# Altium project LOGI-BONE.PrjPcb (part 1 of 2)
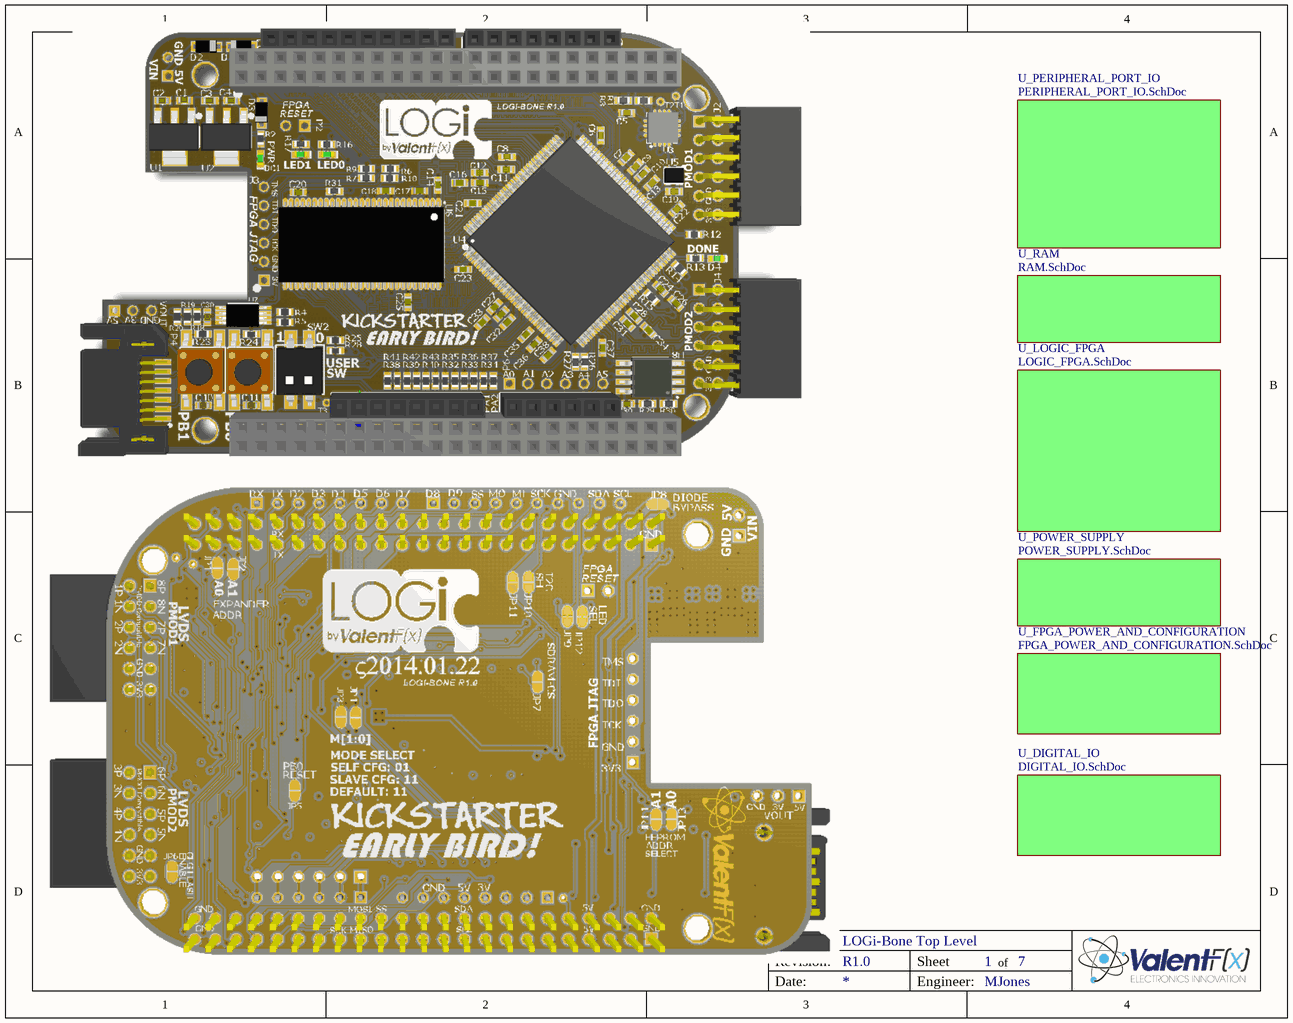
[diagram p0: LOGi_Bone_Top.SchDoc]
Engineer: MJ/EH; PCB_TITLE: FPGA Mark 1; PCB_VERSION: a; PrjEngineer: MJones; PrjRevision: R1.0; Revision: R1.0
7 sheets, 132 parts. Net scope: flat (ports and power ports of the same name join across sheets).
Board file: LOGI-BONE.PcbDoc
Sheets:
  LOGi_Bone_Top.SchDoc
    U_DIGITAL_IO = DIGITAL_IO.SchDoc
    U_FPGA_POWER_AND_CONFIGURATION = FPGA_POWER_AND_CONFIGURATION.SchDoc
    U_LOGIC_FPGA = LOGIC_FPGA.SchDoc
    U_PERIPHERAL_PORT_IO = PERIPHERAL_PORT_IO.SchDoc
    U_POWER_SUPPLY = POWER_SUPPLY.SchDoc
    U_RAM = RAM.SchDoc

## Sheet LOGi_Bone_Top.SchDoc: LOGi-Bone Top Level
size A; Organization: Michael Jones; DocumentNumber: 1; SheetNumber: 1; SheetTotal: 7; PageSetup: Record=PageOptions|CenterHorizontal=True|CenterVertical=True|PrintScale=1.12|XCorrection=1.00|YCorrection=1.00|PrintKind=0|BorderSize=5000000|LeftOffset=0|BottomOffset=0|Orientation=2|PaperLength=1000|PaperWidth=1000|Scale=100|PaperSource=7|PrintQuality=-4|MediaType=1|DitherType=10|PaperKind=Letter|PrintScaleMode=1

### Sub-sheets
U_DIGITAL_IO = DIGITAL_IO.SchDoc: no entries
U_FPGA_POWER_AND_CONFIGURATION = FPGA_POWER_AND_CONFIGURATION.SchDoc: no entries
U_LOGIC_FPGA = LOGIC_FPGA.SchDoc: no entries
U_PERIPHERAL_PORT_IO = PERIPHERAL_PORT_IO.SchDoc: no entries
U_POWER_SUPPLY = POWER_SUPPLY.SchDoc: no entries
U_RAM = RAM.SchDoc: no entries

### Notes on the sheet
- Title
- Revision:
- Sheet
- of
- Date:
- Engineer:

## Sheet DIGITAL_IO.SchDoc: Digital IO
size B; Engineer: M. Jones; Organization: Michael Jones; DocumentNumber: 6; Revision: RA.1; SheetNumber: 6; SheetTotal: 7
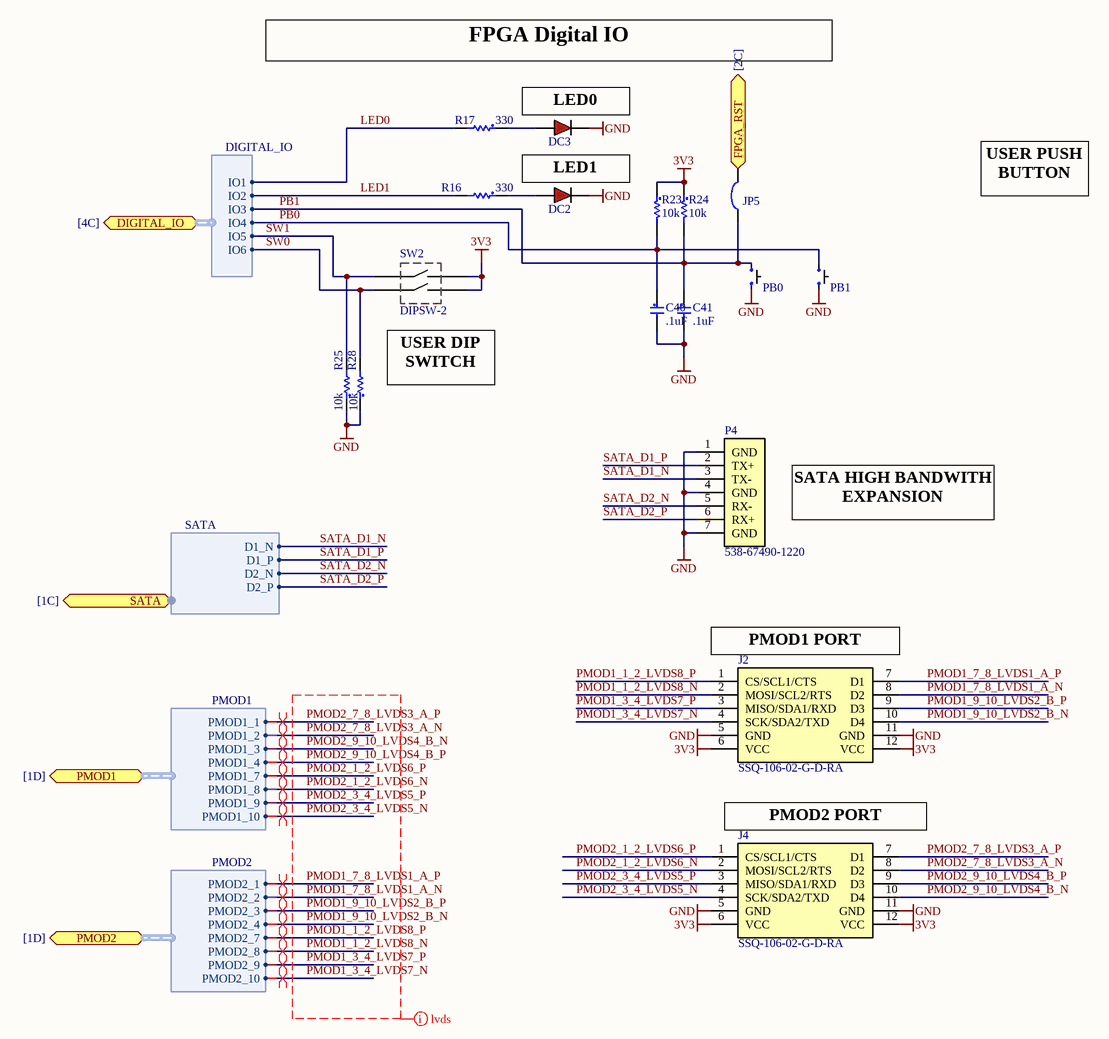
[diagram p1: DIGITAL_IO.SchDoc]

### Parts
C40  .1uF  [c0603]
C41  .1uF  [c0603]
DC2  598-8010-107F  [LED_0603 - RED]  (value not drawn)
DC3  598-8010-107F  [LED_0603 - RED]  (value not drawn)
J2  SSQ-106-02-G-D-RA  [PMOD HEADER - SSQ-106-02-G-D-RA]
J4  SSQ-106-02-G-D-RA  [PMOD HEADER - SSQ-106-02-G-D-RA]
JP5  Solder Jumper  [SOLDER_JUMPER]  (value not drawn)  (no BOM)
P4  Supplier Part Number 1: 538-67490-1220  [SATA - 67490-3220]  (hidden comment: SATA - 67490-1220)
PB0  (no value)  [FSM4JSMA]
PB1  (no value)  [FSM4JSMA]
R16  330  [R0603]
R17  330  [R0603]
R23  10k  [R0603]
R24  10k  [R0603]
R25  10k  [R0603]
R28  10k  [R0603]
SW2  DIPSW-2  [DIPSW - 219-2MST]

### Ports
DIGITAL_IO (harness DIGITAL_IO, see [4C]), FPGA_RST (see [2C]), PMOD1 (harness PMOD1, see [1D]), PMOD2 (harness PMOD2, see [1D]), SATA (harness SATA, see [1C])

### Harnesses
DIGITAL_IO: IO1, IO2, IO3, IO4, IO5, IO6
SATA: D1_P, D1_N, D2_N, D2_P
PMOD1: PMOD1_1, PMOD1_2, PMOD1_3, PMOD1_4, PMOD1_7, PMOD1_8, PMOD1_9, PMOD1_10
PMOD2: PMOD2_1, PMOD2_2, PMOD2_3, PMOD2_4, PMOD2_7, PMOD2_8, PMOD2_9, PMOD2_10

### Nets
3V3: J2.6(VCC) J2.12(VCC) J4.6(VCC) J4.12(VCC) R23.1 R24.1 SW2.B1 SW2.B2
GND: C40.2 C41.2 DC2.C DC3.C J2.5(GND) J2.11(GND) J4.5(GND) J4.11(GND) P4.1(GND) P4.4(GND) P4.7(GND) PB0.A PB1.A R25.1 R28.1
FPGA_RST/CFG_PROGB: JP5.2 ; port FPGA_RST
LED0: R17.2 ; port DIGITAL_IO.IO1
LED1: R16.2 ; port DIGITAL_IO.IO2
PB0: C40.1 PB1.B R23.2 ; port DIGITAL_IO.IO4
PB1: C41.1 JP5.1 PB0.B R24.2 ; port DIGITAL_IO.IO3
PMOD1_1_2_LVDS8_N: J2.2(MOSI/SCL2/RTS) ; port PMOD2.PMOD2_8
PMOD1_1_2_LVDS8_P: J2.1(CS/SCL1/CTS) ; port PMOD2.PMOD2_7
PMOD1_3_4_LVDS7_N: J2.4(SCK/SDA2/TXD) ; port PMOD2.PMOD2_10
PMOD1_3_4_LVDS7_P: J2.3(MISO/SDA1/RXD) ; port PMOD2.PMOD2_9
PMOD1_7_8_LVDS1_A_N: J2.8(D2) ; port PMOD2.PMOD2_2
PMOD1_7_8_LVDS1_A_P: J2.7(D1) ; port PMOD2.PMOD2_1
PMOD1_9_10_LVDS2_B_N: J2.10(D4) ; port PMOD2.PMOD2_4
PMOD1_9_10_LVDS2_B_P: J2.9(D3) ; port PMOD2.PMOD2_3
PMOD2_1_2_LVDS6_N: J4.2(MOSI/SCL2/RTS) ; port PMOD1.PMOD1_8
PMOD2_1_2_LVDS6_P: J4.1(CS/SCL1/CTS) ; port PMOD1.PMOD1_7
PMOD2_3_4_LVDS5_N: J4.4(SCK/SDA2/TXD) ; port PMOD1.PMOD1_10
PMOD2_3_4_LVDS5_P: J4.3(MISO/SDA1/RXD) ; port PMOD1.PMOD1_9
PMOD2_7_8_LVDS3_A_N: J4.8(D2) ; port PMOD1.PMOD1_2
PMOD2_7_8_LVDS3_A_P: J4.7(D1) ; port PMOD1.PMOD1_1
PMOD2_9_10_LVDS4_B_N: J4.10(D4) ; port PMOD1.PMOD1_3
PMOD2_9_10_LVDS4_B_P: J4.9(D3) ; port PMOD1.PMOD1_4
SATA_D1_N: P4.3(TX-) ; port SATA.D1_N
SATA_D1_P: P4.2(TX+) ; port SATA.D1_P
SATA_D2_N: P4.5(RX-) ; port SATA.D2_N
SATA_D2_P: P4.6(RX+) ; port SATA.D2_P
SW0: R28.2 SW2.A2 ; port DIGITAL_IO.IO6
SW1: R25.2 SW2.A1 ; port DIGITAL_IO.IO5
NetDC2_A: DC2.A R16.1
NetDC3_A: DC3.A R17.1

### Layout directives
differential pair: PMOD1_1_2_LVDS8_N, PMOD1_1_2_LVDS8_P, PMOD1_3_4_LVDS7_N, PMOD1_3_4_LVDS7_P, PMOD1_7_8_LVDS1_A_N, PMOD1_7_8_LVDS1_A_P, PMOD1_9_10_LVDS2_B_N, PMOD1_9_10_LVDS2_B_P, PMOD2_1_2_LVDS6_N, PMOD2_1_2_LVDS6_P, PMOD2_3_4_LVDS5_N, PMOD2_3_4_LVDS5_P, PMOD2_7_8_LVDS3_A_N, PMOD2_7_8_LVDS3_A_P, PMOD2_9_10_LVDS4_B_N, PMOD2_9_10_LVDS4_B_P
net class lvds: PMOD1_1_2_LVDS8_N, PMOD1_1_2_LVDS8_P, PMOD1_3_4_LVDS7_N, PMOD1_3_4_LVDS7_P, PMOD1_7_8_LVDS1_A_N, PMOD1_7_8_LVDS1_A_P, PMOD1_9_10_LVDS2_B_N, PMOD1_9_10_LVDS2_B_P, PMOD2_1_2_LVDS6_N, PMOD2_1_2_LVDS6_P, PMOD2_3_4_LVDS5_N, PMOD2_3_4_LVDS5_P, PMOD2_7_8_LVDS3_A_N, PMOD2_7_8_LVDS3_A_P, PMOD2_9_10_LVDS4_B_N, PMOD2_9_10_LVDS4_B_P

### Notes on the sheet
- FPGA Digital IO
- (near DC3) LED0
- (near DC2) LED1
- USER PUSH BUTTON
- USER DIP SWITCH
- SATA HIGH BANDWITH EXPANSION
- (near J2) PMOD1 PORT
- (near J4) PMOD2 PORT
- Title
- Revision:
- Sheet
- of
- Date:
- Engineer:

### Library data of the parts
C40 C41 = C0603 - CL10F104ZA8NNNC: CAP CER 0.1UF 25V Y5V 0603; Manufacturer: Samsung Electro-Mechanics America, Inc; Capacitance: 0.1µF; Tolerance: -20%, +80%; Temperature Coefficient: Y5V (F); Accept Alternative: Yes; Value: .1uF; Supplier 1: Digi-Key; Supplier Part Number 1: 1276-1011-1-ND; Manufacturer Part Number: CL10F104ZA8NNNC; RoHS: RoHS Compliant; Category: Capacitors; Stock 1: 400907; Pricing 1: 1=0.1, 10=0.017, 25=0.012, 50=0.009, 100=0.0076, 250=0.00624, 500=0.00536, 1000=0.00417 (USD); Package / Case: 0603 (1608 Metric); Packaging: Cut Tape (CT); ComponentLink1URL: http://www.samsungsem.com/servlet/FileDownload?type=spec&file=CL10F104ZA8NNNC.pdf; ComponentLink1Description: http://www.samsungsem.com/servlet/FileDownload?type=spec&file=CL10F104ZA8NNNC.pdf; Voltage - Rated: 25V; Mounting Type: Surface Mount, MLCC; Operating Temperature: -30°C ~ 85°C; Applications: General Purpose; Ratings: -; Size / Dimension: 0.063" L x 0.031" W (1.60mm x 0.80mm); Height - Seated (Max): -; Thickness (Max): 0.035" (0.90mm); Lead Spacing: -; Features: -; Lead Style: -; Accept Compatible Replacement Part: Yes
DC2 DC3 = LED0603 - 598-8010-107F: LED ALINGAP RED CLEAR 0603 SMD; Manufacturer: Dialight; Current - Test: 20mA; Wavelength - Dominant: 635nm; Millicandela Rating: 40mcd; Voltage - Forward (Vf) Typ: 2.2V; Lens Style/Size: Rectangle with Flat Top, 1.1mm x 0.8mm; Viewing Angle: 140°; Accept Replacement: YES - Water Clear; Supplier 1: Digi-Key; Manufacturer Part Number: 598-8010-107F; RoHS: RoHS Compliant; Category: Optoelectronics; Stock 1: 37578; Pricing 1: 1=0.45, 10=0.33, 25=0.264, 100=0.1749, 250=0.1452, 500=0.1056, 1000=0.0825 (USD); Color: Red; Luminous Flux @ Current - Test: -; Wavelength - Peak: -; Lens Type: Clear; Size / Dimension: 1.60mm L x 0.80mm W; Height: 0.70mm; Package / Case: 0603 (1608 Metric); Mounting Type: Surface Mount; Packaging: Digi-Reel®; ComponentLink1URL: http://media.digikey.com/pdf/Data%20Sheets/Dialight%20PDFs/598_Series_0603_Pkg.pdf; ComponentLink1Description: http://media.digikey.com/pdf/Data%20Sheets/Dialight%20PDFs/598_Series_0603_Pkg.pdf; Supplier Part Number 1: 350-2029-6-ND
J2 J4 = P-MOD - SSQ-106-02-G-D-RA: SAMTEC - SSQ-106-02-G-D-RA-005 - 2MM SOCKET STRIPS; Supplier 1: Samtec; Supplier Part Number 1: SSQ-106-02-G-D-RA; Manufacturer: SAMTEC; Manufacturer Part Number: SSQ-106-02-G-D-RA; Stock 1: 0; Pricing 1: 1=1.58, 100=1.58, 1000=1.58 (USD); Value: SSQ-106-02-G-D-RA
JP5 = Solder Jumper: Solder/Configuration Jumper; Manufacturer: n/a; Manufacturer Part Number: n/a; Source: n/a; Source Part Number: n/a; ROHS Certificate: n/a
P4 = SATA - 67490-1220: SATA Data - 67490-1220; Manufacturer: Molex; 1Notes: looks more standard need, different footprint; Gender: Male; Pitch: 1.27 mm; Number of Positions / Contacts: 7; Supplier 1: Mouser; Manufacturer Part Number: 67490-1220; RoHS: RoHS Compliant; Category: I/O Connectors; Stock 1: 475; Pricing 1: 1=1.28, 10=1.07, 100=0.792, 500=0.640, 1000=0.572, 2000=0.525 (AUD); Packaging: Tray; Product: SATA Connectors; Termination Style: Solder Terminal; Mounting Style: SMD/SMT; Product Category: 1.27mm Connectors; Standard Pack Qty: 2880; RoHS - Mouser: Y; Minimum Order Quantity: 1; Reeling: False; ComponentLink1URL: http://www.molex.com/webdocs/datasheets/pdf/en-us/0674901220_PCB_HEADERS.pdf; ComponentLink1Description: http://www.molex.com/webdocs/datasheets/pdf/en-us/0674901220_PCB_HEADERS.pdf
PB0 PB1 = FSM4JSMATR: SWITCH TACTILE SPST-NO 0.05A 12V; Manufacturer: TE Connectivity; Switch Function: Off-Mom; Contact Rating @ Voltage: 0.05A @ 12VDC; Actuator Type: Standard; Outline: 6.00mm x 6.00mm; Illumination: Non-Illuminated; Operating Force: 160gf; Actuator Height off PCB, from Pins: 5.00mm; Actuator Orientation: Top Actuated; Actuator Material: Polyphenylene Sulfide (PPS); Switch Travel: 0.25mm; Mechanical Life: 100,000 Cycles; Supplier 1: Digi-Key; Supplier Part Number 1: 450-1129-ND; Manufacturer Part Number: FSM4JSMA; RoHS: RoHS Compliant; Category: Switches; Stock 1: 13038; Pricing 1: 1=0.26, 10=0.246, 25=0.2096, 50=0.1834, 100=0.1703, 250=0.15064, 500=0.1441, 1000=0.1179, 5000=0.09825 (USD); Circuit: SPST-NO; Mounting Type: Surface Mount; Termination Style: Gull Wing; Packaging: Bulk; ComponentLink1URL: http://www.te.com/commerce/DocumentDelivery/DDEController?Action=srchrtrv&DocNm=2-1437565-7&DocType=Customer+Drawing&DocLang=English; ComponentLink1Description: http://www.te.com/commerce/DocumentDelivery/DDEController?Action=srchrtrv&DocNm=2-1437565-7&DocType=Customer+Drawing&DocLang=English; Illumination Voltage (Nominal): -; Illumination Type, Color: -; Ingress Protection: -; Features: -; Operating Temperature: -35°C ~ 85°C
R16 R17 = R0603 - ERJ-3GEYJ331V: Thick Film Resistors - SMD 0603 330ohms 5% Tol; Manufacturer: Panasonic; Temperature Coefficient: 200 PPM / C; Power Rating: 100 mW; Voltage Rating: 75 V; Manufacturer Part Number: ERJ-3GEYJ331V; Value: 330; Supplier 1: Mouser; Supplier Part Number 1: 667-ERJ-3GEYJ331V; RoHS: RoHS Compliant By Exemption; Category: Thick Film Resistors - SMD; Stock 1: 131470; Pricing 1: 1=0.108, 10=0.012, 100=0.005, 1000=0.004, 5000=0.003 (AUD); Tolerance: 5 %; Packaging: Reel; Package / Case: 0603 (1608 metric); ComponentLink1URL: http://www.mouser.com/ds/2/315/AOA0000CE1-37422.pdf; ComponentLink1Description: http://www.mouser.com/ds/2/315/AOA0000CE1-37422.pdf; Dimensions: 0.8 mm W x 1.6 mm L x 0.45 mm H; Operating Temperature Range: - 55 C to + 155 C; Product: Thick Film Resistors SMD; Resistance: 330 Ohms; Series: ERJ; Termination Style: SMD/SMT; Case Code - in: 0603; Case Code - mm: 1608; Standard Pack Qty: 5000; RoHS - Mouser: E; Minimum Order Quantity: 1; Reeling: True
R23-R25 R28 = R0603 - CRCW060310K0FKEA: 10k Thick Film Resistors - SMD 1/10watt 10Kohms 1%; Manufacturer: Vishay Dale; Power (Watts): 0.1W, 1/10W; Temperature Coefficient: ±100ppm/°C; Supplier 1: Digi-Key; Manufacturer Part Number: CRCW060310K0FKEA; RoHS: RoHS Compliant; Category: Resistors; Stock 1: 997856; Pricing 1: 10=0.081, 50=0.0436, 200=0.0251, 1000=0.01711 (USD); Resistance (Ohms): 10K; Composition: Thick Film; Features: -; Tolerance: ±1%; Package / Case: 0603 (1608 Metric); Size / Dimension: 0.061" L x 0.033" W (1.55mm x 0.85mm); Height: 0.020" (0.50mm); Number of Terminations: 2; Packaging: Cut Tape (CT); ComponentLink1URL: http://www.vishay.com/doc?20035; ComponentLink1Description: http://www.vishay.com/doc?20035; Supplier Part Number 1: 541-10.0KHCT-ND; Value: 10k
SW2 = DIPSW - 219-2MST: DIP Switches / SIP Switches SPST 2 switch sections; Manufacturer: CTS Electronic Components; Number of Positions: 2; Supplier 1: Mouser; Manufacturer Part Number: 219-2MST; RoHS: RoHS Compliant; Category: DIP Switches / SIP Switches; Stock 1: 3237; Pricing 1: 1=0.580, 10=0.530, 100=0.480, 500=0.350, 1000=0.300, 5000=0.270 (USD); Operating Temperature Range: - 55 C to + 85 C; Packaging: Tube; Terminal Pitch: 2.54 mm; Termination Style: SMD/SMT; Switch Type: DIP; Product Category: DIP Switches; RoHS - Mouser: Y; Minimum Order Quantity: 1; Reeling: False; ComponentLink1URL: http://www.ctscorp.com/components/Datasheets/219.pdf; ComponentLink1Description: http://www.ctscorp.com/components/Datasheets/219.pdf; Supplier Part Number 1: 774-2192MST

## Sheet FPGA_POWER_AND_CONFIGURATION.SchDoc: FPGA Configuration
size B; Engineer: M. Jones; Organization: Michael Jones; DocumentNumber: 3; Revision: R1.0; SheetNumber: 3; SheetTotal: 7
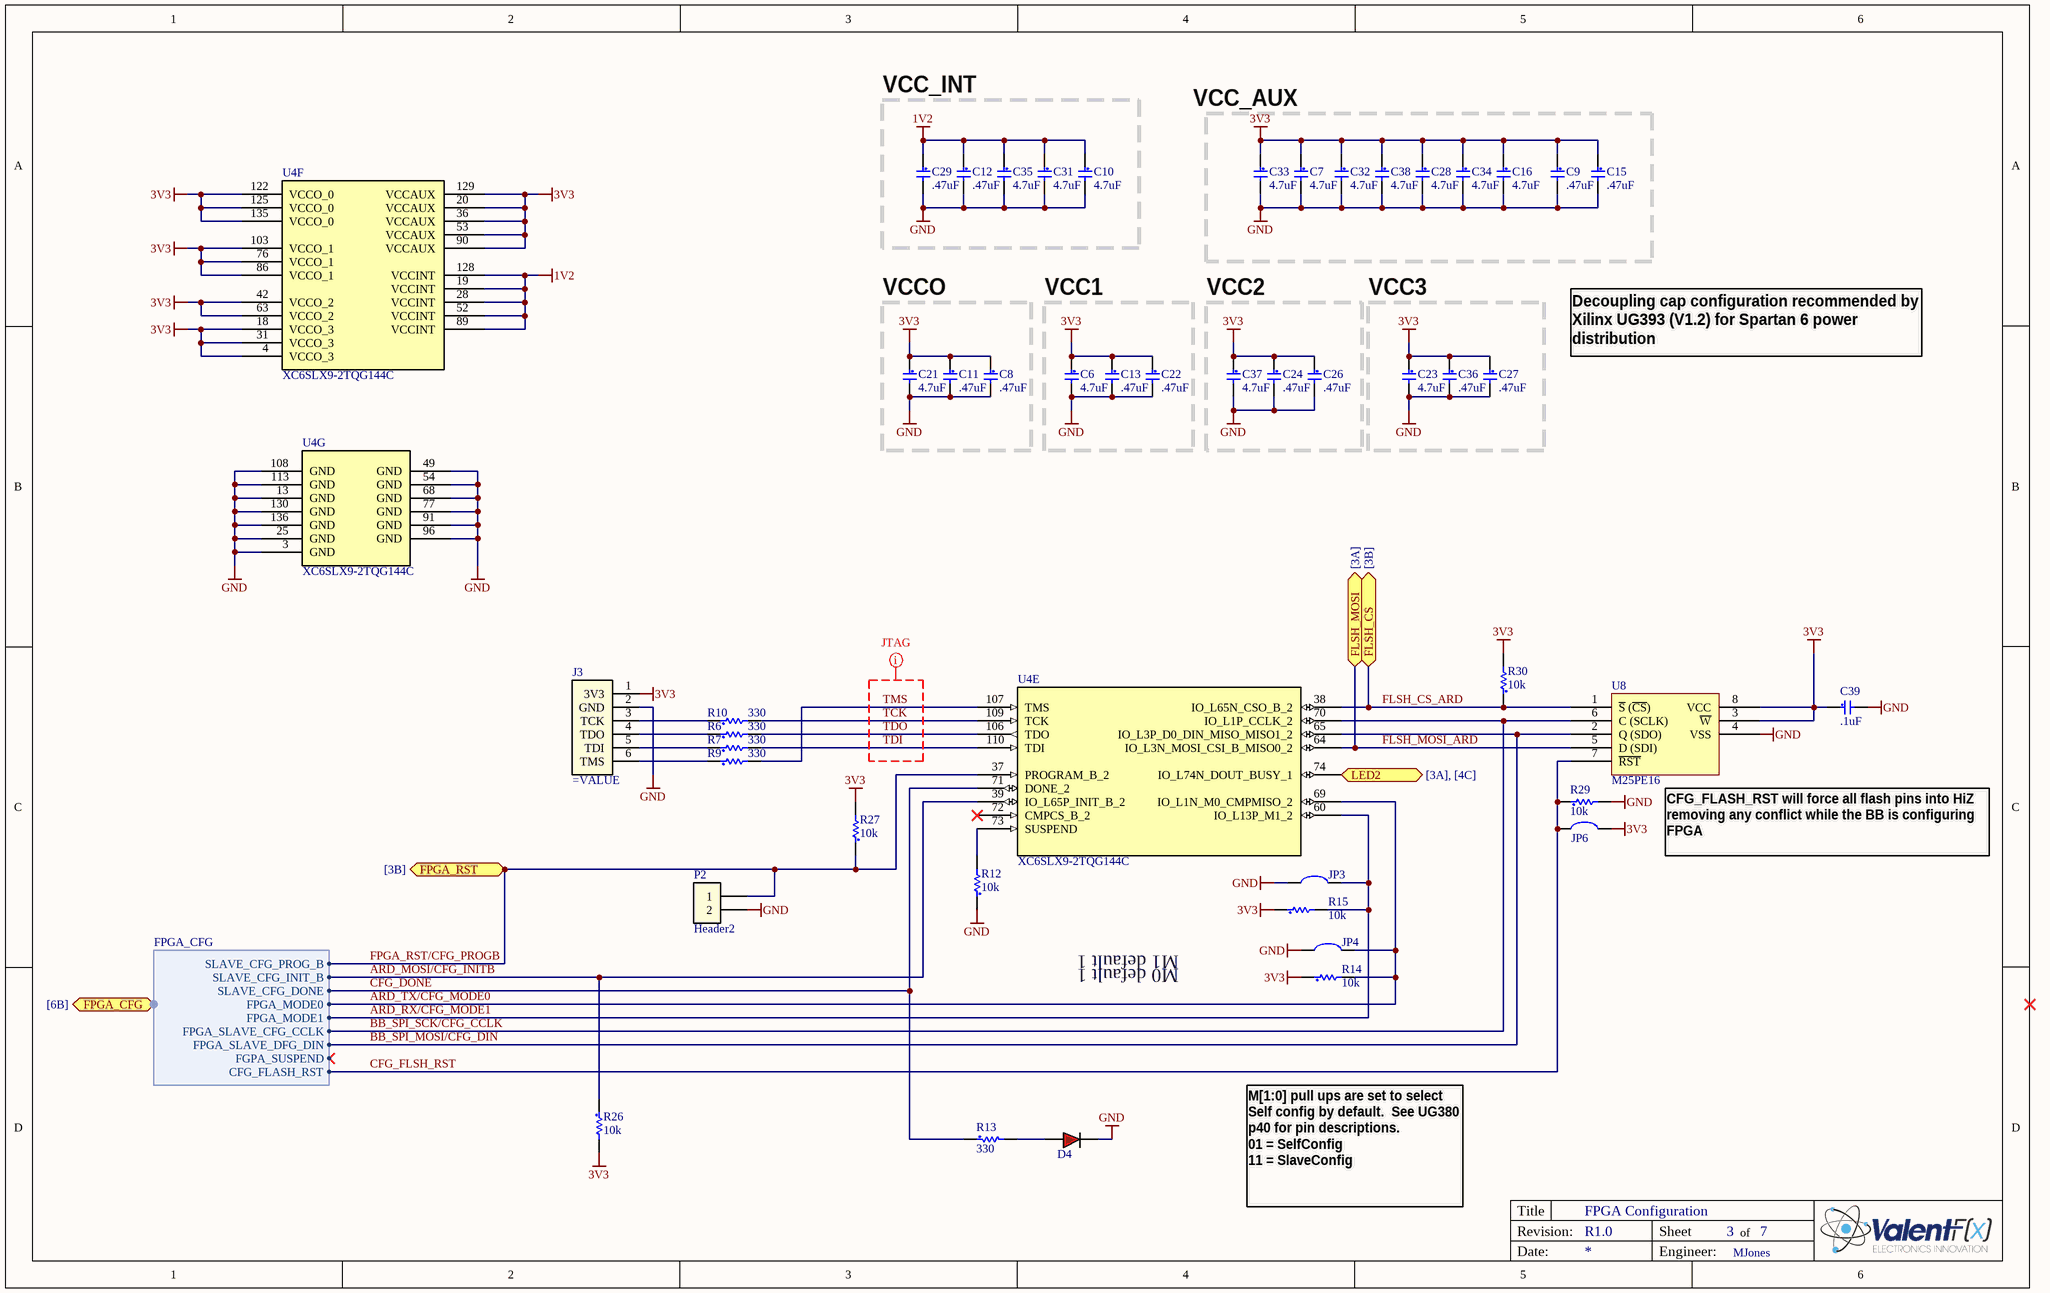
[diagram p2: FPGA_POWER_AND_CONFIGURATION.SchDoc]

### Parts
C6  4.7uF  [C0603 - Marked]
C7  4.7uF  [C0603 - Marked]
C8  .47uF  [C0603]
C9  .47uF  [C0603]
C10  4.7uF  [C0603 - Marked]
C11  .47uF  [C0603]
C12  .47uF  [C0603]
C13  .47uF  [C0603]
C15  .47uF  [C0603]
C16  4.7uF  [C0603 - Marked]
C21  4.7uF  [C0603 - Marked]
C22  .47uF  [C0603]
C23  4.7uF  [C0603 - Marked]
C24  .47uF  [C0603]
C26  .47uF  [C0603]
C27  .47uF  [C0603]
C28  4.7uF  [C0603 - Marked]
C29  .47uF  [C0603]
C31  4.7uF  [C0603 - Marked]
C32  4.7uF  [C0603 - Marked]
C33  4.7uF  [C0603 - Marked]
C34  4.7uF  [C0603 - Marked]
C35  4.7uF  [C0603 - Marked]
C36  .47uF  [C0603]
C37  4.7uF  [C0603 - Marked]
C38  4.7uF  [C0603 - Marked]
C39  .1uF  [c0603]
D4  598-8010-107F  [LED_0603 - RED]  (value not drawn)
J3  (no value)  [JTAG - Digilent HS1 RA]  (no BOM)
JP3  Solder Jumper  [SOLDER_JUMPER]  (value not drawn)  (no BOM)
JP4  Solder Jumper  [SOLDER_JUMPER]  (value not drawn)  (no BOM)
JP6  Solder Jumper  [SOLDER_JUMPER]  (value not drawn)  (no BOM)
P2  Header2  [HEADER_2_40_100 THRU SIP]  (no BOM)
R6  330  [R0603]
R7  330  [R0603]
R9  330  [R0603]
R10  330  [R0603]
R12  10k  [R0603]
R13  330  [R0603]
R14  10k  [R0603]
R15  10k  [R0603]
R26  10k  [R0603]
R27  10k  [R0603]
R29  10k  [R0603]
R30  10k  [R0603]
U4  XC6SLX9-2TQG144C  [TQ144_L]  (parts E,F,G of 7)
U8  M25PE16  [SOIC127P830X200-8L]

### Blocks framed on the sheet
VCC_INT: C10 C12 C29 C31 C35
VCCO: C8 C11 C21
VCC1: C6 C13 C22
VCC2: C24 C26 C37
VCC3: C23 C27 C36

### Ports
FLSH_CS (see [3B]), FLSH_MOSI (see [3A]), FPGA_CFG (harness FPGA_CFG, see [6B]), FPGA_RST (see [3B]), LED2 (see [3A], [4C])

### Harnesses
FPGA_CFG: SLAVE_CFG_PROG_B, SLAVE_CFG_INIT_B, SLAVE_CFG_DONE, FPGA_MODE0, FPGA_MODE1, FPGA_SLAVE_CFG_CCLK, FPGA_SLAVE_DFG_DIN, FGPA_SUSPEND, CFG_FLASH_RST

### Nets
1V2: C10.1 C12.1 C29.1 C31.1 C35.1 U4.19(VCCINT) U4.28(VCCINT) U4.52(VCCINT) U4.89(VCCINT) U4.128(VCCINT)
3V3: C6.1 C7.1 C8.1 C9.1 C11.1 C13.1 C15.1 C16.1 C21.1 C22.1 C23.1 C24.1 C26.1 C27.1 C28.1 C32.1 C33.1 C34.1 C36.1 C37.1 C38.1 C39.1 J3.1(3V3) JP6.1 R14.1 R15.1 R26.2 R27.2 R30.2 U4.4(VCCO_3) U4.18(VCCO_3) U4.20(VCCAUX) U4.31(VCCO_3) U4.36(VCCAUX) U4.42(VCCO_2) U4.53(VCCAUX) U4.63(VCCO_2) U4.76(VCCO_1) U4.86(VCCO_1) U4.90(VCCAUX) U4.103(VCCO_1) U4.122(VCCO_0) U4.125(VCCO_0) U4.129(VCCAUX) U4.135(VCCO_0) U8.3(~{W}) U8.8(VCC)
GND: C6.2 C7.2 C8.2 C9.2 C10.2 C11.2 C12.2 C13.2 C15.2 C16.2 C21.2 C22.2 C23.2 C24.2 C26.2 C27.2 C28.2 C29.2 C31.2 C32.2 C33.2 C34.2 C35.2 C36.2 C37.2 C38.2 C39.2 D4.C J3.2(GND) JP3.2 JP4.2 P2.2 R12.1 R29.2 U4.3(GND) U4.13(GND) U4.25(GND) U4.49(GND) U4.54(GND) U4.68(GND) U4.77(GND) U4.91(GND) U4.96(GND) U4.108(GND) U4.113(GND) U4.130(GND) U4.136(GND) U8.4(VSS)
ARD_MOSI/CFG_INITB: R26.1 U4.39(IO_L65P_INIT_B_2) ; port FPGA_CFG.SLAVE_CFG_INIT_B
ARD_RX/CFG_MODE1: JP3.1 R15.2 U4.60(IO_L13P_M1_2) ; port FPGA_CFG.FPGA_MODE1
ARD_TX/CFG_MODE0: JP4.1 R14.2 U4.69(IO_L1N_M0_CMPMISO_2) ; port FPGA_CFG.FPGA_MODE0
BB_SPI_MOSI/CFG_DIN: U4.65(IO_L3P_D0_DIN_MISO_MISO1_2) U8.2(Q_(SDO)) ; port FPGA_CFG.FPGA_SLAVE_DFG_DIN
BB_SPI_SCK/CFG_CCLK: U4.70(IO_L1P_CCLK_2) U8.6(C_(SCLK)) ; port FPGA_CFG.FPGA_SLAVE_CFG_CCLK
CFG_DONE: R13.1 U4.71(DONE_2) ; port FPGA_CFG.SLAVE_CFG_DONE
CFG_FLSH_RST: JP6.2 R29.1 U8.7(~{RST}) ; port FPGA_CFG.CFG_FLASH_RST
FLSH_CS_ARD: R30.1 U4.38(IO_L65N_CSO_B_2) U8.1(~{S}_(~{CS})) ; port FLSH_CS
FLSH_MOSI_ARD: U4.64(IO_L3N_MOSI_CSI_B_MISO0_2) U8.5(D_(SDI)) ; port FLSH_MOSI
FPGA_RST/CFG_PROGB: P2.1 R27.1 U4.37(PROGRAM_B_2) ; port FPGA_RST, port FPGA_CFG.SLAVE_CFG_PROG_B
LED1: U4.74(IO_L74N_DOUT_BUSY_1) ; port LED2
TCK: R10.2 U4.109(TCK)
TDI: R7.2 U4.110(TDI)
TDO: R6.2 U4.106(TDO)
TMS: R9.2 U4.107(TMS)
NetD4_A: D4.A R13.2
NetJ3_3: J3.3(TCK) R10.1
NetJ3_4: J3.4(TDO) R6.1
NetJ3_5: J3.5(TDI) R7.1
NetJ3_6: J3.6(TMS) R9.1
NetR12_2: R12.2 U4.73(SUSPEND)

Not connected (* = marked no-connect by the designer): U4 72(CMPCS_B_2)*

### Layout directives
net class JTAG: TCK, TDI, TDO, TMS

### Notes on the sheet
- VCC_AUX
- Decoupling cap configuration recommended by Xilinx UG393 (V1.2) for Spartan 6 power distribution
- (near U8) CFG_FLASH_RST will force all flash pins into HiZ removing any conflict while the BB is configuring FPGA
- M0 default 1
- M1 default 1
- M[1:0] pull ups are set to select Self config by default.  See UG380 p40 for pin descriptions.
  01 = SelfConfig
  11 = SlaveConfig
- Title
- Revision:
- Sheet
- of
- Date:
- Engineer:

### Library data of the parts
C6 C7 C10 C16 C21 C23 C28 C31-C35 C37 C38 = C0603 - GRM188R60J475KE19D: 4.7uF 6.3volts X5R 10% (MLCC) - SMD/SMT 0603; Manufacturer: Murata Electronics North America; Accept Compatible Replacement Part: Yes; Capacitance: 4.7µF; Voltage - Rated: 6.3V; Supplier 1: Digi-Key; Manufacturer Part Number: GRM188R60J475KE19D; RoHS: RoHS Compliant; Category: Capacitors; Stock 1: 614848; Pricing 1: 1=0.19, 10=0.132, 50=0.076, 100=0.0627, 250=0.05284, 500=0.04426, 1000=0.03633 (USD); Tolerance: ±10%; Package / Case: 0603 (1608 Metric); Packaging: Cut Tape (CT); ComponentLink1URL: http://search.murata.co.jp/Ceramy/image/img/PDF/ENG/GRM188R60J475KE19.pdf; ComponentLink1Description: http://search.murata.co.jp/Ceramy/image/img/PDF/ENG/GRM188R60J475KE19.pdf; Value: 4.7uF; Temperature Coefficient: X5R; Mounting Type: Surface Mount, MLCC; Operating Temperature: -55°C ~ 85°C; Applications: General Purpose; Ratings: -; Size / Dimension: 0.063" L x 0.031" W (1.60mm x 0.80mm); Height - Seated (Max): -; Thickness (Max): 0.035" (0.90mm); Lead Spacing: -; Features: -; Lead Style: -; Supplier Part Number 1: 490-3297-1-ND
C8 C9 C11-C13 C15 C22 C24 C26 C27 C29 C36 = C0603 - GCM188R71E474KA64D: .47uF 25VDC X7R 10% SMD 0603 Paper T/R CERAMIC; Manufacturer: Murata Electronics North America; Accept Compatible Replacement Part: Yes; Capacitance: 0.47µF; Voltage - Rated: 25V; Supplier 1: Digi-Key; Supplier Part Number 1: 490-4776-1-ND; Manufacturer Part Number: GCM188R71E474KA64D; RoHS: RoHS Compliant; Stock 1: 100000; Pricing 1: 1=0.26, 10=0.214, 50=0.1202, 100=0.1068, 250=0.08012, 500=0.07076, 1000=0.06275 (USD); ComponentLink1URL: http://search.murata.co.jp/Ceramy/image/img/PDF/ENG/GCM188R71E474KA64.pdf; ComponentLink1Description: http://search.murata.co.jp/Ceramy/image/img/PDF/ENG/GCM188R71E474KA64.pdf; Value: .47uF; Category: Capacitors; Tolerance: ±10%; Temperature Coefficient: X7R; Mounting Type: Surface Mount, MLCC; Operating Temperature: -55°C ~ 125°C; Applications: Automotive; Ratings: AEC-Q200; Package / Case: 0603 (1608 Metric); Size / Dimension: 0.063" L x 0.031" W (1.60mm x 0.80mm); Height - Seated (Max): -; Thickness (Max): 0.035" (0.90mm); Lead Spacing: -; Features: -; Packaging: Cut Tape (CT); Lead Style: -
C39 = C0603 - CL10F104ZA8NNNC: as C40 on sheet DIGITAL_IO; Supplier 1: Digi-Key; Manufacturer Part Number: CL10F104ZA8NNNC; RoHS: RoHS Compliant; Category: Capacitors; Stock 1: 400907; Pricing 1: 1=0.1, 10=0.017, 25=0.012, 50=0.009, 100=0.0076, 250=0.00624, 500=0.00536, 1000=0.00417 (USD); Package / Case: 0603 (1608 Metric); Packaging: Cut Tape (CT); ComponentLink1URL: http://www.samsungsem.com/servlet/FileDownload?type=spec&file=CL10F104ZA8NNNC.pdf; ComponentLink1Description: http://www.samsungsem.com/servlet/FileDownload?type=spec&file=CL10F104ZA8NNNC.pdf; Supplier Part Number 1: 1276-1011-1-ND; Value: .1uF; Voltage - Rated: 25V; Mounting Type: Surface Mount, MLCC; Operating Temperature: -30°C ~ 85°C; Applications: General Purpose; Ratings: -; Size / Dimension: 0.063" L x 0.031" W (1.60mm x 0.80mm); Height - Seated (Max): -; Thickness (Max): 0.035" (0.90mm); Lead Spacing: -; Features: -; Lead Style: -; Accept Compatible Replacement Part: Yes
D4 = LED0603 - 598-8010-107F: as DC2 on sheet DIGITAL_IO; Supplier 1: Digi-Key; Supplier Part Number 1: 350-2029-6-ND; Manufacturer Part Number: 598-8010-107F; RoHS: RoHS Compliant; Category: Optoelectronics; Stock 1: 37578; Pricing 1: 1=0.45, 10=0.33, 25=0.264, 100=0.1749, 250=0.1452, 500=0.1056, 1000=0.0825 (USD); Color: Red; Luminous Flux @ Current - Test: -; Wavelength - Peak: -; Lens Type: Clear; Size / Dimension: 1.60mm L x 0.80mm W; Height: 0.70mm; Package / Case: 0603 (1608 Metric); Mounting Type: Surface Mount; Packaging: Digi-Reel®; ComponentLink1URL: http://media.digikey.com/pdf/Data%20Sheets/Dialight%20PDFs/598_Series_0603_Pkg.pdf; ComponentLink1Description: http://media.digikey.com/pdf/Data%20Sheets/Dialight%20PDFs/598_Series_0603_Pkg.pdf
J3 = JTAG - Digilent HS1: DIGILENT - 410-205 - PROGRAMMING CABLE, JTAG HS1, USB2; Manufacturer: Samtec; Manufacturer Part Number: TSW-106-08-G-S-RA; Lead Time: 0 weeks; Peak Solder Temperature: 260 deg C; MSL Level Min: N/R; Connector Type: Header, Unshrouded; Number of Positions: 6; Number of Positions Loaded: All; Pitch: 0.100" (2.54mm); Supplier 1: Arrow; RoHS: CHINA ROHS: Compliant / EU ROHS: Compliant; Stock 1: 0; Pricing 1: 0=0.2649 (USD); ComponentLink1URL: http://components.arrow.com/partservice/dataview/altium/2677508S3639200N1004?apiKey=aa438727d59eed98c4bed826d8d949c84cb5e685b92bf87346a0226bd2658797; ComponentLink1Description: http://components.arrow.com/partservice/dataview/altium/2677508S3639200N1004?apiKey=aa438727d59eed98c4bed826d8d949c84cb5e685b92bf87346a0226bd2658797; Supplier Part Number 1: 2677508S3639200N1004; Package Quantity: 1; Termination Finish: Au/Ni; MSL Level Max: N/R; MSL (Moisture Sensitivity Level): N/R; China ROHS Lead (X -> above / O -> below threshold): O; China ROHS Mercury (X -> above / O -> below threshold): O; China ROHS Cadmium (X -> above / O -> below threshold): O; China ROHS Hex Chromium (X -> above / O -> below threshold): O; China ROHS PBB (X -> above / O -> below threshold): O; China ROHS PBDE (X -> above / O -> below threshold): O; EU_ROHS_PROD_EXEMPTION_BY_SUPP: N/R; Supplier 2: Digi-Key; Category: Connectors, Interconnects; Stock 2: 0; Pricing 2: 1=0.94, 10=0.841, 100=0.6926, 500=0.5475, 1000=0.46999, 5000=0.42877, 10000=0.41228 (USD); Contact Type: Male Pin; Number of Rows: 1; Row Spacing: -; Contact Mating Length: 0.230" (5.84mm); Mounting Type: Through Hole; Termination: Solder; Fastening Type: -; Features: -; Contact Finish: Gold; Contact Finish Thickness: 10µin (0.25µm); Color: Black; Packaging: Bulk; ComponentLink2URL: http://www.samtec.com/documents/webfiles/cpdf/TSW-XXX-XX-XXX-X-XX-XXX-MKT.pdf; ComponentLink2Description: http://www.samtec.com/documents/webfiles/cpdf/TSW-XXX-XX-XXX-X-XX-XXX-MKT.pdf; Supplier Part Number 2: SAM1038-06-ND
JP3 JP4 JP6 = Solder Jumper: Solder/Configuration Jumper; Manufacturer: n/a; Manufacturer Part Number: n/a; Source: n/a; Source Part Number: n/a; ROHS Certificate: n/a
P2 = Header2: Header 2 pin
R6 R7 R9 R10 = R0603 - ERJ-3GEYJ331V: Thick Film Resistors - SMD 0603 330ohms 5% Tol; Manufacturer: Panasonic; Power Rating: 100 mW; Temperature Coefficient: 200 PPM / C; Voltage Rating: 75 V; Supplier 1: Mouser; Manufacturer Part Number: ERJ-3GEYJ331V; RoHS: RoHS Compliant By Exemption; Category: Thick Film Resistors - SMD; Stock 1: 131470; Pricing 1: 1=0.108, 10=0.012, 100=0.005, 1000=0.004, 5000=0.003 (AUD); Dimensions: 0.8 mm W x 1.6 mm L x 0.45 mm H; Operating Temperature Range: - 55 C to + 155 C; Package / Case: 0603 (1608 metric); Packaging: Reel; Product: Thick Film Resistors SMD; Resistance: 330 Ohms; Series: ERJ; Termination Style: SMD/SMT; Tolerance: 5 %; Standard Pack Qty: 5000; RoHS - Mouser: E; Minimum Order Quantity: 1; Reeling: True; ComponentLink1URL: http://www.mouser.com/ds/2/315/AOA0000CE1-37422.pdf; ComponentLink1Description: http://www.mouser.com/ds/2/315/AOA0000CE1-37422.pdf; Supplier Part Number 1: 667-ERJ-3GEYJ331V; Value: 330; Case Code - in: 0603; Case Code - mm: 1608
R12 R14 R15 R26 R27 R29 R30 = R0603 - CRCW060310K0FKEA: as R23 on sheet DIGITAL_IO; Manufacturer Part Number: CRCW060310K0FKEA; Value: 10k; Supplier 1: Digi-Key; RoHS: RoHS Compliant; Category: Resistors; Stock 1: 997856; Pricing 1: 10=0.081, 50=0.0436, 200=0.0251, 1000=0.01711 (USD); Resistance (Ohms): 10K; Composition: Thick Film; Features: -; Tolerance: ±1%; Size / Dimension: 0.061" L x 0.033" W (1.55mm x 0.85mm); Height: 0.020" (0.50mm); Packaging: Cut Tape (CT); Package / Case: 0603 (1608 Metric); ComponentLink1URL: http://www.vishay.com/doc?20035; ComponentLink1Description: http://www.vishay.com/doc?20035; Supplier Part Number 1: 541-10.0KHCT-ND; Number of Terminations: 2
R13 = R0603 - ERJ-3GEYJ331V: as R16 on sheet DIGITAL_IO; Manufacturer Part Number: ERJ-3GEYJ331V; Value: 330; Supplier 1: Mouser; Supplier Part Number 1: 667-ERJ-3GEYJ331V; RoHS: RoHS Compliant By Exemption; Category: Thick Film Resistors - SMD; Stock 1: 131470; Pricing 1: 1=0.108, 10=0.012, 100=0.005, 1000=0.004, 5000=0.003 (AUD); Tolerance: 5 %; Packaging: Reel; Package / Case: 0603 (1608 metric); ComponentLink1URL: http://www.mouser.com/ds/2/315/AOA0000CE1-37422.pdf; ComponentLink1Description: http://www.mouser.com/ds/2/315/AOA0000CE1-37422.pdf; Dimensions: 0.8 mm W x 1.6 mm L x 0.45 mm H; Operating Temperature Range: - 55 C to + 155 C; Product: Thick Film Resistors SMD; Resistance: 330 Ohms; Series: ERJ; Termination Style: SMD/SMT; Case Code - in: 0603; Case Code - mm: 1608; Standard Pack Qty: 5000; RoHS - Mouser: E; Minimum Order Quantity: 1; Reeling: True
U4 = FPGA - XC6SLX9-2TQG144C: IC FPAG SPARTAN 6 9K 144TQFP; Manufacturer: Xilinx Inc; Number of Logic Elements/Cells: 9152; Number of LABs/CLBs: 715; Total RAM Bits: 589824; Number of I /O: 102; Voltage - Supply: 1.14 V ~ 1.26 V; Supplier 1: America II Electronics; Supplier Part Number 1: 122-1745-ND; Manufacturer Part Number: XC6SLX9-2TQG144C; RoHS: RoHS Compliant; Category: Integrated Circuits (ICs); Stock 1: 994; Pricing 1: 1=12.80,1=11.05,1000=9.59 (USD); Number of Gates: -; Mounting Type: Surface Mount; Operating Temperature: 0°C ~ 85°C; Package / Case: 144-LQFP; Supplier Device Package: 144-TQFP (20x20); ComponentLink1URL: http://www.xilinx.com/support/documentation/data_sheets/ds160.pdf; ComponentLink1Description: http://www.xilinx.com/support/documentation/data_sheets/ds160.pdf; Value: XC6SLX9-2TQG144C; Supplier 2: Digi-Key
U8 = M25PE16-VMW6TG: IC FLASH 16MBIT 75MHZ 8SOIC; Manufacturer: Numonyx/ST Micro; Memory Size: 16M (2M x 8); Interface: SPI, 3-Wire Serial; Voltage - Supply: 2.7 V ~ 3.6 V; Supplier 1: Digi-Key; Manufacturer Part Number: M25PE16-VMW6TG; RoHS: RoHS Compliant; Category: Integrated Circuits (ICs); Stock 1: 866; Pricing 1: 1=2.31, 10=1.98, 25=1.782, 100=1.617, 250=1.452, 500=1.254 (USD); Format - Memory: FLASH; Memory Type: FLASH; Speed: 75MHz; Operating Temperature: -40°C ~ 85°C; Package / Case: 8-SOIC (0.200", 5.30mm Width); Packaging: Cut Tape (CT); Supplier Device Package: *; ComponentLink1URL: http://www.numonyx.com/Documents/Datasheets/M25PE16.pdf; ComponentLink1Description: http://www.numonyx.com/Documents/Datasheets/M25PE16.pdf; Supplier Part Number 1: M25PE16-VMW6TGCT-ND; Value: M25PE16

## Sheet LOGIC_FPGA.SchDoc: FPGA Logic
size B; Engineer: M. Jones; Organization: Michael Jones; DocumentNumber: 4; Revision: RA2.1; SheetNumber: 4; SheetTotal: 7
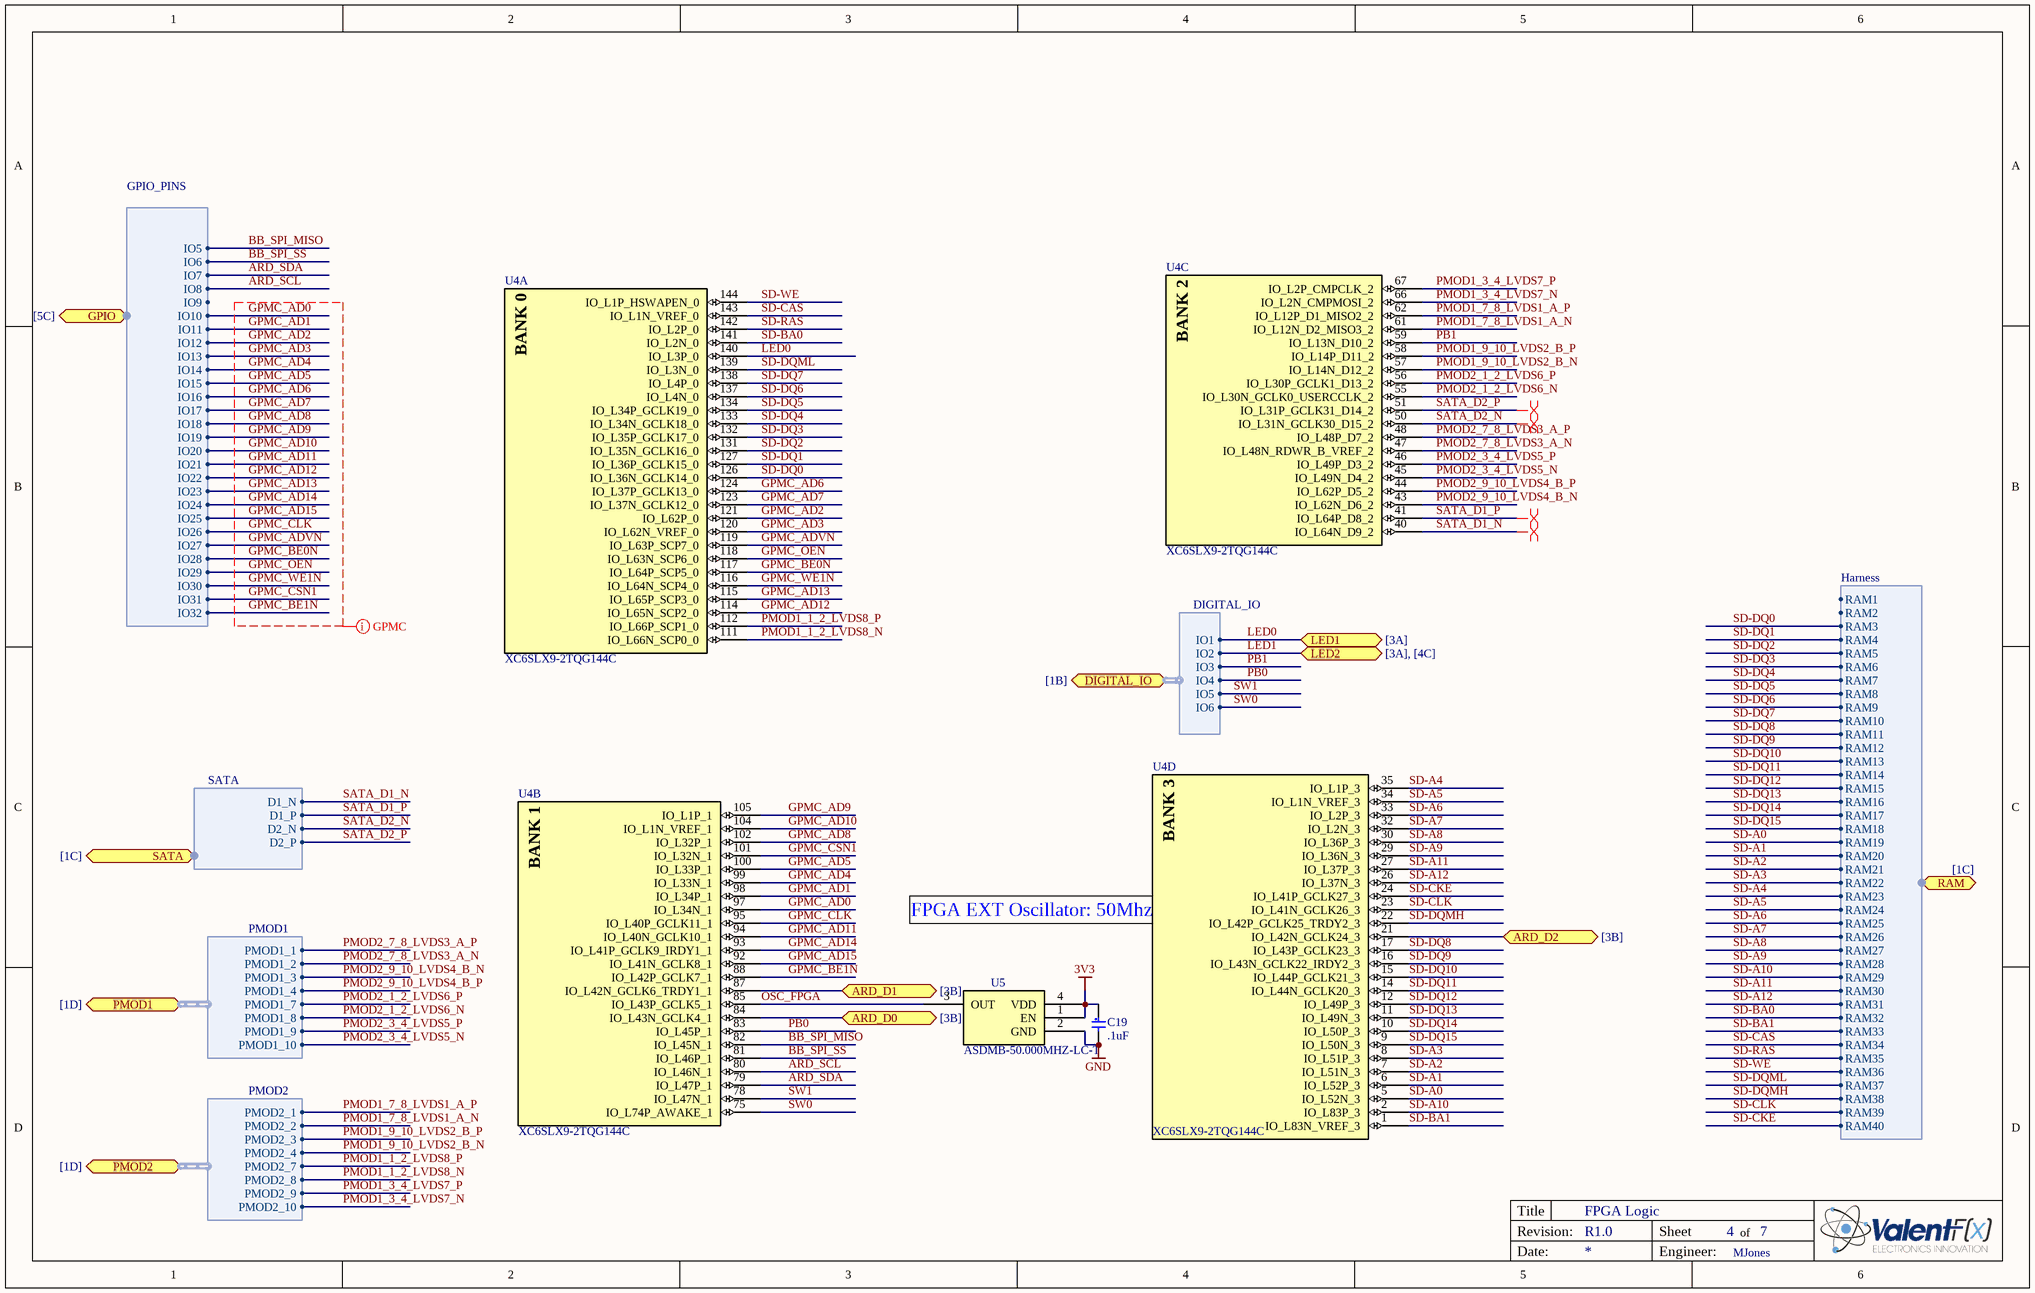
[diagram p3: LOGIC_FPGA.SchDoc]

### Parts
C19  .1uF  [c0603]
U4  XC6SLX9-2TQG144C  [TQ144_L]  (parts A,B,C,D of 7)
U5  ASDMB-50.000MHZ-LC-T  [ASDMB - osc]

### Ports
ARD_D0 (see [3B]), ARD_D1 (see [3B]), ARD_D2 (see [3B]), DIGITAL_IO (harness DIGITAL_IO, see [1B]), GPIO (harness GPIO_PINS, see [5C]), LED1 (see [3A]), LED2 (see [3A], [4C]), PMOD1 (harness PMOD1, see [1D]), PMOD2 (harness PMOD2, see [1D]), RAM (harness Harness, see [1C]), SATA (harness SATA, see [1C])

### Harnesses
SATA: D1_P, D1_N, D2_N, D2_P
Harness: RAM1, RAM2, RAM3, RAM4, RAM5, RAM6, RAM7, RAM8, RAM9, RAM10, RAM11, RAM12, RAM13, RAM14, RAM15, RAM16, RAM17, RAM18, RAM19, RAM20, RAM21, RAM22, RAM23, RAM24, RAM25, RAM26, RAM27, RAM28, RAM29, RAM30, RAM31, RAM32, RAM33, RAM34, RAM35, RAM36, RAM37, RAM38, RAM39, RAM40
PMOD1: PMOD1_1, PMOD1_2, PMOD1_3, PMOD1_4, PMOD1_7, PMOD1_8, PMOD1_9, PMOD1_10
PMOD2: PMOD2_1, PMOD2_2, PMOD2_3, PMOD2_4, PMOD2_7, PMOD2_8, PMOD2_9, PMOD2_10
DIGITAL_IO: IO1, IO2, IO3, IO4, IO5, IO6
GPIO_PINS: IO5, IO6, IO7, IO8, IO9, IO10, IO11, IO12, IO13, IO14, IO15, IO16, IO17, IO18, IO19, IO20, IO21, IO22, IO23, IO24, IO25, IO26, IO27, IO28, IO29, IO30, IO31, IO32

### Nets
3V3: C19.1 U5.1(EN) U5.4(VDD)
GND: C19.2 U5.2(GND)
ARD_D0: U4.84(IO_L43N_GCLK4_1) ; port ARD_D0
ARD_D2: U4.21(IO_L42N_GCLK24_3) ; port ARD_D2
ARD_SCL: U4.80(IO_L46N_1) ; port GPIO.IO8
ARD_SDA: U4.79(IO_L47P_1) ; port GPIO.IO7
BB_SPI_MISO: U4.82(IO_L45N_1) ; port GPIO.IO5
BB_SPI_SS: U4.81(IO_L46P_1) ; port GPIO.IO6
GPMC_AD0: U4.97(IO_L34N_1) ; port GPIO.IO10
GPMC_AD1: U4.98(IO_L34P_1) ; port GPIO.IO11
GPMC_AD2: U4.121(IO_L62P_0) ; port GPIO.IO12
GPMC_AD3: U4.120(IO_L62N_VREF_0) ; port GPIO.IO13
GPMC_AD4: U4.99(IO_L33N_1) ; port GPIO.IO14
GPMC_AD5: U4.100(IO_L33P_1) ; port GPIO.IO15
GPMC_AD6: U4.124(IO_L37P_GCLK13_0) ; port GPIO.IO16
GPMC_AD7: U4.123(IO_L37N_GCLK12_0) ; port GPIO.IO17
GPMC_AD8: U4.102(IO_L32P_1) ; port GPIO.IO18
GPMC_AD9: U4.105(IO_L1P_1) ; port GPIO.IO19
GPMC_AD10: U4.104(IO_L1N_VREF_1) ; port GPIO.IO20
GPMC_AD11: U4.94(IO_L40N_GCLK10_1) ; port GPIO.IO21
GPMC_AD12: U4.114(IO_L65N_SCP2_0) ; port GPIO.IO22
GPMC_AD13: U4.115(IO_L65P_SCP3_0) ; port GPIO.IO23
GPMC_AD14: U4.93(IO_L41P_GCLK9_IRDY1_1) ; port GPIO.IO24
GPMC_AD15: U4.92(IO_L41N_GCLK8_1) ; port GPIO.IO25
GPMC_ADVN: U4.119(IO_L63P_SCP7_0) ; port GPIO.IO27
GPMC_BE0N: U4.117(IO_L64P_SCP5_0) ; port GPIO.IO28
GPMC_BE1N: U4.88(IO_L42P_GCLK7_1) ; port GPIO.IO32
GPMC_CLK: U4.95(IO_L40P_GCLK11_1) ; port GPIO.IO26
GPMC_CSN1: U4.101(IO_L32N_1) ; port GPIO.IO31
GPMC_OEN: U4.118(IO_L63N_SCP6_0) ; port GPIO.IO29
GPMC_WE1N: U4.116(IO_L64N_SCP4_0) ; port GPIO.IO30
LED0: U4.140(IO_L3P_0) ; port LED1, port DIGITAL_IO.IO1
LED1: port LED2, port DIGITAL_IO.IO2
OSC_FPGA: U4.85(IO_L43P_GCLK5_1) U5.3(OUT)
PB0: U4.83(IO_L45P_1) ; port DIGITAL_IO.IO4
PB1: U4.59(IO_L13N_D10_2) ; port DIGITAL_IO.IO3
PMOD1_1_2_LVDS8_N: U4.111(IO_L66N_SCP0_0) ; port PMOD2.PMOD2_8
PMOD1_1_2_LVDS8_P: U4.112(IO_L66P_SCP1_0) ; port PMOD2.PMOD2_7
PMOD1_3_4_LVDS7_N: U4.66(IO_L2N_CMPMOSI_2) ; port PMOD2.PMOD2_10
PMOD1_3_4_LVDS7_P: U4.67(IO_L2P_CMPCLK_2) ; port PMOD2.PMOD2_9
PMOD1_7_8_LVDS1_A_N: U4.61(IO_L12N_D2_MISO3_2) ; port PMOD2.PMOD2_2
PMOD1_7_8_LVDS1_A_P: U4.62(IO_L12P_D1_MISO2_2) ; port PMOD2.PMOD2_1
PMOD1_9_10_LVDS2_B_N: U4.57(IO_L14N_D12_2) ; port PMOD2.PMOD2_4
PMOD1_9_10_LVDS2_B_P: U4.58(IO_L14P_D11_2) ; port PMOD2.PMOD2_3
PMOD2_1_2_LVDS6_N: U4.55(IO_L30N_GCLK0_USERCCLK_2) ; port PMOD1.PMOD1_8
PMOD2_1_2_LVDS6_P: U4.56(IO_L30P_GCLK1_D13_2) ; port PMOD1.PMOD1_7
PMOD2_3_4_LVDS5_N: U4.45(IO_L49N_D4_2) ; port PMOD1.PMOD1_10
PMOD2_3_4_LVDS5_P: U4.46(IO_L49P_D3_2) ; port PMOD1.PMOD1_9
PMOD2_7_8_LVDS3_A_N: U4.47(IO_L48N_RDWR_B_VREF_2) ; port PMOD1.PMOD1_2
PMOD2_7_8_LVDS3_A_P: U4.48(IO_L48P_D7_2) ; port PMOD1.PMOD1_1
PMOD2_9_10_LVDS4_B_N: U4.43(IO_L62N_D6_2) ; port PMOD1.PMOD1_3
PMOD2_9_10_LVDS4_B_P: U4.44(IO_L62P_D5_2) ; port PMOD1.PMOD1_4
SATA_D1_N: U4.40(IO_L64N_D9_2) ; port SATA.D1_N
SATA_D1_P: U4.41(IO_L64P_D8_2) ; port SATA.D1_P
SATA_D2_N: U4.50(IO_L31N_GCLK30_D15_2) ; port SATA.D2_N
SATA_D2_P: U4.51(IO_L31P_GCLK31_D14_2) ; port SATA.D2_P
SD-A0: U4.5(IO_L52N_3) ; port RAM.RAM19
SD-A1: U4.6(IO_L52P_3) ; port RAM.RAM20
SD-A2: U4.7(IO_L51N_3) ; port RAM.RAM21
SD-A3: U4.8(IO_L51P_3) ; port RAM.RAM22
SD-A4: U4.35(IO_L1P_3) ; port RAM.RAM23
SD-A5: U4.34(IO_L1N_VREF_3) ; port RAM.RAM24
SD-A6: U4.33(IO_L2P_3) ; port RAM.RAM25
SD-A7: U4.32(IO_L2N_3) ; port RAM.RAM26
SD-A8: U4.30(IO_L36P_3) ; port RAM.RAM27
SD-A9: U4.29(IO_L36N_3) ; port RAM.RAM28
SD-A10: U4.2(IO_L83P_3) ; port RAM.RAM29
SD-A11: U4.27(IO_L37P_3) ; port RAM.RAM30
SD-A12: U4.26(IO_L37N_3) ; port RAM.RAM31
SD-BA0: U4.141(IO_L2N_0) ; port RAM.RAM32
SD-BA1: U4.1(IO_L83N_VREF_3) ; port RAM.RAM33
SD-CAS: U4.143(IO_L1N_VREF_0) ; port RAM.RAM34
SD-CKE: U4.24(IO_L41P_GCLK27_3) ; port RAM.RAM40
SD-CLK: U4.23(IO_L41N_GCLK26_3) ; port RAM.RAM39
SD-DQ0: U4.126(IO_L36N_GCLK14_0) ; port RAM.RAM3
SD-DQ1: U4.127(IO_L36P_GCLK15_0) ; port RAM.RAM4
SD-DQ2: U4.131(IO_L35N_GCLK16_0) ; port RAM.RAM5
SD-DQ3: U4.132(IO_L35P_GCLK17_0) ; port RAM.RAM6
SD-DQ4: U4.133(IO_L34N_GCLK18_0) ; port RAM.RAM7
SD-DQ5: U4.134(IO_L34P_GCLK19_0) ; port RAM.RAM8
SD-DQ6: U4.137(IO_L4N_0) ; port RAM.RAM9
SD-DQ7: U4.138(IO_L4P_0) ; port RAM.RAM10
SD-DQ8: U4.17(IO_L43P_GCLK23_3) ; port RAM.RAM11
SD-DQ9: U4.16(IO_L43N_GCLK22_IRDY2_3) ; port RAM.RAM12
SD-DQ10: U4.15(IO_L44P_GCLK21_3) ; port RAM.RAM13
SD-DQ11: U4.14(IO_L44N_GCLK20_3) ; port RAM.RAM14
SD-DQ12: U4.12(IO_L49P_3) ; port RAM.RAM15
SD-DQ13: U4.11(IO_L49N_3) ; port RAM.RAM16
SD-DQ14: U4.10(IO_L50P_3) ; port RAM.RAM17
SD-DQ15: U4.9(IO_L50N_3) ; port RAM.RAM18
SD-DQMH: U4.22(IO_L42P_GCLK25_TRDY2_3) ; port RAM.RAM38
SD-DQML: U4.139(IO_L3N_0) ; port RAM.RAM37
SD-RAS: U4.142(IO_L2P_0) ; port RAM.RAM35
SD-WE: U4.144(IO_L1P_HSWAPEN_0) ; port RAM.RAM36
SW0: U4.75(IO_L74P_AWAKE_1) ; port DIGITAL_IO.IO6
SW1: U4.78(IO_L47N_1) ; port DIGITAL_IO.IO5
NetPA-3_C2: U4.87(IO_L42N_GCLK6_TRDY1_1) ; port ARD_D1

### Layout directives
net class GPMC: GPMC_AD0, GPMC_AD1, GPMC_AD2, GPMC_AD3, GPMC_AD4, GPMC_AD5, GPMC_AD6, GPMC_AD7, GPMC_AD8, GPMC_AD9, GPMC_AD10, GPMC_AD11, GPMC_AD12, GPMC_AD13, GPMC_AD14, GPMC_AD15, GPMC_ADVN, GPMC_BE0N, GPMC_BE1N, GPMC_CLK, GPMC_CSN1, GPMC_OEN, GPMC_WE1N
differential pair: SATA_D1_N, SATA_D1_P, SATA_D2_N, SATA_D2_P

### Notes on the sheet
- FPGA EXT Oscillator: 50Mhz
- Title
- Revision:
- Sheet
- of
- Date:
- Engineer:
- (in symbol FPGA - XC6SLX9-2TQG144C, part A) BANK 0
- (in symbol FPGA - XC6SLX9-2TQG144C, part B) BANK 1
- (in symbol FPGA - XC6SLX9-2TQG144C, part C) BANK 2
- (in symbol FPGA - XC6SLX9-2TQG144C, part D) BANK 3

### Library data of the parts
C19 = C0603 - CL10F104ZA8NNNC: as C40 on sheet DIGITAL_IO; Manufacturer Part Number: CL10F104ZA8NNNC; Value: .1uF; Supplier 1: Digi-Key; Supplier Part Number 1: 1276-1011-1-ND; RoHS: RoHS Compliant; Category: Capacitors; Stock 1: 400907; Pricing 1: 1=0.1, 10=0.017, 25=0.012, 50=0.009, 100=0.0076, 250=0.00624, 500=0.00536, 1000=0.00417 (USD); Package / Case: 0603 (1608 Metric); Packaging: Cut Tape (CT); ComponentLink1URL: http://www.samsungsem.com/servlet/FileDownload?type=spec&file=CL10F104ZA8NNNC.pdf; ComponentLink1Description: http://www.samsungsem.com/servlet/FileDownload?type=spec&file=CL10F104ZA8NNNC.pdf; Voltage - Rated: 25V; Mounting Type: Surface Mount, MLCC; Operating Temperature: -30°C ~ 85°C; Applications: General Purpose; Ratings: -; Size / Dimension: 0.063" L x 0.031" W (1.60mm x 0.80mm); Height - Seated (Max): -; Thickness (Max): 0.035" (0.90mm); Lead Spacing: -; Features: -; Lead Style: -; Accept Compatible Replacement Part: Yes
U4 = FPGA - XC6SLX9-2TQG144C: as U4 on sheet FPGA_POWER_AND_CONFIGURATION; Supplier 1: America II Electronics; Supplier Part Number 1: 122-1745-ND; Manufacturer Part Number: XC6SLX9-2TQG144C; RoHS: RoHS Compliant; Category: Integrated Circuits (ICs); Stock 1: 994; Pricing 1: 1=12.80,1=11.05,1000=9.59 (USD); Number of Gates: -; Mounting Type: Surface Mount; Operating Temperature: 0°C ~ 85°C; Package / Case: 144-LQFP; Supplier Device Package: 144-TQFP (20x20); ComponentLink1URL: http://www.xilinx.com/support/documentation/data_sheets/ds160.pdf; ComponentLink1Description: http://www.xilinx.com/support/documentation/data_sheets/ds160.pdf; Value: XC6SLX9-2TQG144C; Supplier 2: Digi-Key
U5 = ASDMB-50.000MHZ-LC-T: OSC MEMS 50.000 MHZ SMD; Manufacturer: Abracon Corporation; Frequency: 50MHz; Function: Tri-State (Output Enable); Output: CMOS; Voltage - Supply: 1.8 V ~ 3.3 V; Frequency Stability: ±50ppm; Current - Supply (Max): 16mA; Current - Supply (Disable) (Max): 15µA; Supplier 1: Digi-Key; Manufacturer Part Number: ASDMB-50.000MHZ-LC-T; RoHS: RoHS Compliant; Category: Crystals and Oscillators; Stock 1: 967; Pricing 1: 1=1.69, 10=1.463, 50=1.2826, 100=1.0125, 500=0.855 (USD); Type: MEMS (Silicon); Operating Temperature: -40°C ~ 85°C; Mounting Type: Surface Mount; Size / Dimension: 0.098" L x 0.079" W (2.50mm x 2.00mm); Height: 0.035" (0.90mm); Package / Case: 4-SMD, No Lead (DFN, LCC); Packaging: Cut Tape (CT); ComponentLink1URL: http://www.abracon.com/Oscillators/ASDMB.pdf; ComponentLink1Description: http://www.abracon.com/Oscillators/ASDMB.pdf; Supplier Part Number 1: 535-11738-1-ND; Value: ASDMB-50.000MHZ-LC-T